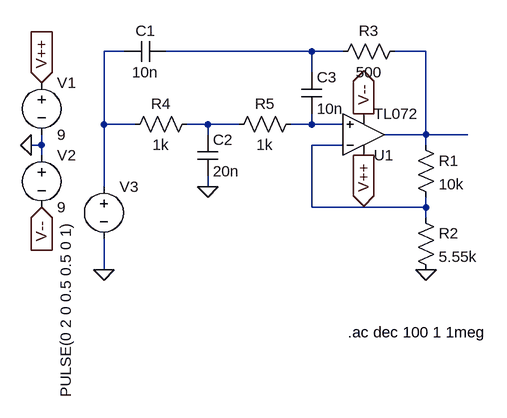
[diagram p0: schematic NotchTwintSecondOrder.asc]
NotchTwintSecondOrder.asc, the LTspice schematic file:
Version 4
SHEET 1 880 680
WIRE 256 128 224 128
WIRE 544 128 320 128
WIRE 592 128 544 128
WIRE 720 128 672 128
WIRE 544 160 544 128
WIRE 224 240 224 128
WIRE 272 240 224 240
WIRE 384 240 352 240
WIRE 432 240 384 240
WIRE 544 240 544 224
WIRE 544 240 512 240
WIRE 592 240 544 240
WIRE 384 256 384 240
WIRE 720 256 720 128
WIRE 720 256 656 256
WIRE 784 256 720 256
WIRE 128 272 128 256
WIRE 128 272 112 272
WIRE 592 272 544 272
WIRE 720 272 720 256
WIRE 128 288 128 272
WIRE 224 336 224 240
WIRE 384 336 384 320
WIRE 544 368 544 272
WIRE 720 368 720 352
WIRE 720 368 544 368
WIRE 720 384 720 368
WIRE 224 464 224 416
FLAG 112 272 0
FLAG 128 176 V++
IOPIN 128 176 In
FLAG 128 368 V--
IOPIN 128 368 In
FLAG 224 464 0
FLAG 624 224 V--
IOPIN 624 224 Out
FLAG 624 288 V++
IOPIN 624 288 Out
FLAG 720 464 0
FLAG 384 336 0
SYMBOL Voltage 128 160 R0
SYMATTR InstName V1
SYMATTR Value 9
SYMBOL Voltage 128 272 R0
SYMATTR InstName V2
SYMATTR Value 9
SYMBOL Voltage 224 320 R0
WINDOW 3 -59 70 VRight 2
SYMATTR Value PULSE(0 2 0 0.5 0.5 0 1)
SYMATTR InstName V3
SYMATTR Value2 AC 1
SYMBOL OpAmps/TL072 624 320 M180
SYMATTR InstName U1
SYMBOL Res 704 256 R0
SYMATTR InstName R1
SYMATTR Value 10k
SYMBOL Res 704 368 R0
SYMATTR InstName R2
SYMATTR Value 5.55k
SYMBOL Res 688 112 R90
WINDOW 0 0 56 VBottom 2
WINDOW 3 32 56 VTop 2
SYMATTR InstName R3
SYMATTR Value 500
SYMBOL Res 368 224 R90
WINDOW 0 0 56 VBottom 2
WINDOW 3 32 56 VTop 2
SYMATTR InstName R4
SYMATTR Value 1k
SYMBOL Cap 368 256 R0
SYMATTR InstName C2
SYMATTR Value 20n
SYMBOL Res 528 224 R90
WINDOW 0 0 56 VBottom 2
WINDOW 3 32 56 VTop 2
SYMATTR InstName R5
SYMATTR Value 1k
SYMBOL Cap 320 112 R90
WINDOW 0 0 32 VBottom 2
WINDOW 3 32 32 VTop 2
SYMATTR InstName C1
SYMATTR Value 10n
SYMBOL Cap 528 160 R0
SYMATTR InstName C3
SYMATTR Value 10n
TEXT 600 560 Left 2 !.ac dec 100 1 1meg

The netlist it stands for:
* NotchTwintSecondOrder.asc
V1 V++ 0 9
V2 0 V-- 9
V3 N001 0 PULSE(0 2 0 0.5 0.5 0 1) AC 1
XU1 N005 N006 V++ V-- N003 TL072  ; pins In+ In- V+ V- OUT
R1 N003 N006 10k
R2 N006 0 5.55k
R3 N003 N002 500
R4 N004 N001 1k
C2 N004 0 20n
R5 N005 N004 1k
C1 N002 N001 10n
C3 N002 N005 10n
.ac dec 100 1 1meg
.backanno
.end